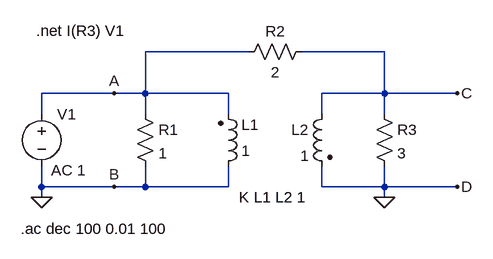
[diagram p0: schematic Ejercicio1.asc]
Ejercicio1.asc, the LTspice schematic file:
Version 4
SHEET 1 880 680
WIRE 272 64 112 64
WIRE 480 64 352 64
WIRE 64 128 -48 128
WIRE 112 128 112 64
WIRE 112 128 64 128
WIRE 240 128 112 128
WIRE 480 128 480 64
WIRE 480 128 384 128
WIRE 592 128 480 128
WIRE -48 160 -48 128
WIRE 112 160 112 128
WIRE 240 160 240 128
WIRE 384 160 384 128
WIRE 480 160 480 128
WIRE -48 272 -48 240
WIRE 64 272 -48 272
WIRE 112 272 112 240
WIRE 112 272 64 272
WIRE 240 272 240 240
WIRE 240 272 112 272
WIRE 384 272 384 240
WIRE 480 272 480 240
WIRE 480 272 384 272
WIRE 592 272 480 272
WIRE -48 288 -48 272
WIRE 480 288 480 272
FLAG -48 288 0
FLAG 64 128 A
FLAG 64 272 B
FLAG 592 128 C
FLAG 592 272 D
FLAG 480 288 0
SYMBOL voltage -48 144 R0
WINDOW 123 15 102 Left 2
WINDOW 39 0 0 Left 0
SYMATTR Value2 AC 1
SYMATTR InstName V1
SYMATTR Value ""
SYMBOL res 96 144 R0
SYMATTR InstName R1
SYMATTR Value 1
SYMBOL ind2 224 256 M180
WINDOW 0 36 80 Left 2
WINDOW 3 36 40 Left 2
SYMATTR InstName L1
SYMATTR Value 1
SYMATTR Type ind
SYMBOL ind2 400 144 M0
SYMATTR InstName L2
SYMATTR Value 1
SYMATTR Type ind
SYMBOL res 464 144 R0
SYMATTR InstName R3
SYMATTR Value 3
SYMBOL res 368 48 R90
WINDOW 0 0 56 VBottom 2
WINDOW 3 32 56 VTop 2
SYMATTR InstName R2
SYMATTR Value 2
TEXT 256 288 Left 2 !K L1 L2 1
TEXT -56 32 Left 2 !.net I(R3) V1
TEXT -80 336 Left 2 !.ac dec 100 0.01 100

The netlist it stands for:
* Ejercicio1.asc
V1 A 0 AC 1
R1 A 0 1
L1 0 A 1
L2 C 0 1
R3 C 0 3
R2 C A 2
K L1 L2 1
.net I(R3) V1
.ac dec 100 0.01 100
.backanno
.end